# Altium schematic sheet GateDriver.SchDoc
size A
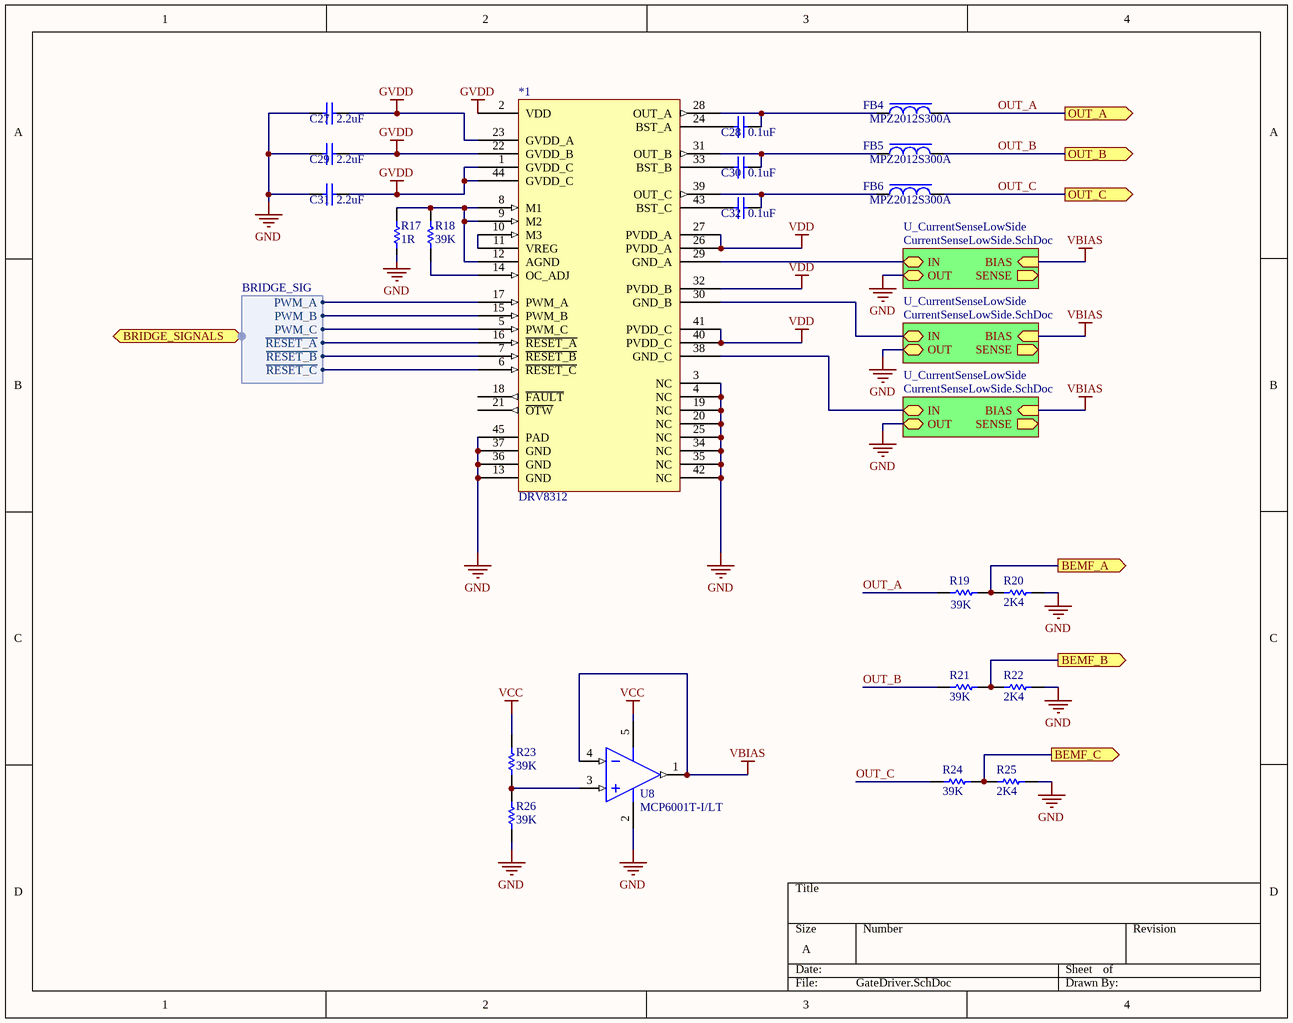
[diagram p0: GateDriver.SchDoc]

## Parts
*1  DRV8312  [HTSSOP-44E]
C27  2.2uF  [CAPC0603(1608)100_M]
C28  0.1uF  [CAPC0603(1608)100_L]
C29  2.2uF  [CAPC0603(1608)100_M]
C30  0.1uF  [CAPC0603(1608)100_L]
C31  2.2uF  [CAPC0603(1608)100_M]
C32  0.1uF  [CAPC0603(1608)100_L]
FB4  MPZ2012S300A  [0805-Ferrite]
FB5  MPZ2012S300A  [0805-Ferrite]
FB6  MPZ2012S300A  [0805-Ferrite]
R17  1R  [RESC0603(1608)_M]
R18  39K  [RESC0603(1608)_M]
R19  39K  [RESC0603(1608)_M]
R20  2K4  [RESC0603(1608)_L]
R21  39K  [RESC0603(1608)_M]
R22  2K4  [RESC0603(1608)_L]
R23  39K  [RESC0603(1608)_M]
R24  39K  [RESC0603(1608)_M]
R25  2K4  [RESC0603(1608)_L]
R26  39K  [RESC0603(1608)_M]
U8  MCP6001T-I/LT  [SC70-LT5_M]

## Sub-sheets
U_CurrentSenseLowSide = CurrentSenseLowSide.SchDoc: SENSE (out), BIAS (in), IN, OUT
U_CurrentSenseLowSide = CurrentSenseLowSide.SchDoc: SENSE (out), BIAS (in), IN, OUT
U_CurrentSenseLowSide = CurrentSenseLowSide.SchDoc: SENSE (out), BIAS (in), IN, OUT

## Ports
BEMF_A (out), BEMF_B (out), BEMF_C (out), BRIDGE_SIGNALS (harness BRIDGE_SIG), OUT_A (out), OUT_B (out), OUT_C (out)

## Harnesses
BRIDGE_SIG: PWM_A, PWM_B, PWM_C, ~{RESET_A}, ~{RESET_B}, ~{RESET_C}

## Nets
GND: *1.3(NC) *1.4(NC) *1.13(GND) *1.19(NC) *1.20(NC) *1.25(NC) *1.34(NC) *1.35(NC) *1.36(GND) *1.37(GND) *1.42(NC) *1.45(PAD) C27.2 C29.2 C31.2 R17.2 R20.1 R22.1 R25.1 R26.1 U8.2(VSS) ; sheet U_CurrentSenseLowSide/OUT, sheet U_CurrentSenseLowSide/OUT, sheet U_CurrentSenseLowSide/OUT
GVDD: *1.1(GVDD_C) *1.2(VDD) *1.22(GVDD_B) *1.23(GVDD_A) *1.44(GVDD_C) C27.1 C29.1 C31.1
VBIAS: U8.1(VOUT) U8.4(VIN-) ; sheet U_CurrentSenseLowSide/BIAS, sheet U_CurrentSenseLowSide/BIAS, sheet U_CurrentSenseLowSide/BIAS
VCC: R23.2 U8.5(VDD)
VDD: *1.26(PVDD_A) *1.27(PVDD_A) *1.32(PVDD_B) *1.40(PVDD_C) *1.41(PVDD_C)
BEMF_A: R19.1 R20.2 ; port BEMF_A
BEMF_B: R21.1 R22.2 ; port BEMF_B
BEMF_C: R24.1 R25.2 ; port BEMF_C
OUT_A: FB4.2 R19.2 ; port OUT_A
OUT_B: FB5.2 R21.2 ; port OUT_B
OUT_C: FB6.2 R24.2 ; port OUT_C
Net*1_5: *1.5(PWM_C) ; port BRIDGE_SIGNALS.PWM_C
Net*1_6: *1.6(~{RESET_C}) ; port BRIDGE_SIGNALS.~{RESET_C}
Net*1_7: *1.7(~{RESET_B}) ; port BRIDGE_SIGNALS.~{RESET_B}
Net*1_8: *1.8(M1) *1.9(M2) *1.12(AGND) R17.1 R18.2
Net*1_10: *1.10(M3) *1.11(VREG)
Net*1_14: *1.14(OC_ADJ) R18.1
Net*1_15: *1.15(PWM_B) ; port BRIDGE_SIGNALS.PWM_B
Net*1_16: *1.16(~{RESET_A}) ; port BRIDGE_SIGNALS.~{RESET_A}
Net*1_17: *1.17(PWM_A) ; port BRIDGE_SIGNALS.PWM_A
Net*1_24: *1.24(BST_A) C28.1
Net*1_28: *1.28(OUT_A) C28.2 FB4.1
Net*1_29: *1.29(GND_A) ; sheet U_CurrentSenseLowSide/IN
Net*1_30: *1.30(GND_B) ; sheet U_CurrentSenseLowSide/IN
Net*1_31: *1.31(OUT_B) C30.2 FB5.1
Net*1_33: *1.33(BST_B) C30.1
Net*1_38: *1.38(GND_C) ; sheet U_CurrentSenseLowSide/IN
Net*1_39: *1.39(OUT_C) C32.2 FB6.1
Net*1_43: *1.43(BST_C) C32.1
NetR23_1: R23.1 R26.2 U8.3(VIN+)

Not connected (* = marked no-connect by the designer): *1 18(~{FAULT}) 21(~{OTW})

## Library data of the parts
C27 C29 C31 = CMP-1035-02767-1: CAP 2.2uF 25V ±10% 0603 (1608 Metric) Thickness 1mm SMD; Case-EIA: 0603; Tolerance: Â±10%; Case-Metric: 1608; Technology: SMT; Value: 2.2uF; Max Thickness: 1 mm; Rated Voltage: 25 V
C28 C30 C32 = CMP-1035-02595-1: CAP 100nF 100V ±10% 0603 (1608 Metric) Thickness 1mm SMD; Tolerance: Â±10%; Case-EIA: 0603; Case-Metric: 1608; Rated Voltage: 100 V; Value: 100nF; Technology: SMT; Max Thickness: 1 mm
R17 = CMP-1012-00002-1: 1R 0.1W 5% 0603 (1608 Metric)  SMD; Value: 1.00 Ohm; Case-Metric: 1608; Case-EIA: 0603; Power: 0.1 W; Technology: SMT; Tolerance: 5 %
R18 R19 R21 R23 R24 R26 = CMP-1012-00689-1: 39K 0.1W 1% 0603 (1608 Metric)  SMD; Case-Metric: 1608; Case-EIA: 0603; Value: 39000.00 Ohm; Technology: SMT; Tolerance: 1 %; Power: 0.1 W
R20 R22 R25 = CMP-1012-00551-1: 2K4 0.1W 1% 0603 (1608 Metric)  SMD; Case-EIA: 0603; Case-Metric: 1608; Value: 2400.00 Ohm; Technology: SMT; Tolerance: 1 %; Power: 0.1 W
U8 = CMP-0187-00457-2: 1 MHz, Low-Power Operational Amplifier, 5-Pin SC-70, Industrial Temperature, Tape and Reel; RevisionNote: URLs added.; ComponentLink2Description: Datasheet; ComponentLink3URL: http://www.microchip.com/stellent/groups/techpub_sg/documents/packagingspec/en012702.pdf; PackageReference: SC70-LT5; PackageDescription: 5-Lead Plastic Small Outline Transistor (LT) [SC70]; ComponentLink2URL: http://ww1.microchip.com/downloads/en/DeviceDoc/21733j.pdf; ComponentLink3Description: Package Specification; PackageVersion: revBB, Aug-2009; ComponentLink1Description: Manufacturer URL; DatasheetVersion: revJ, Nov-2009; ComponentLink1URL: http://www.microchip.com/; Code_IPC: SOT353-5